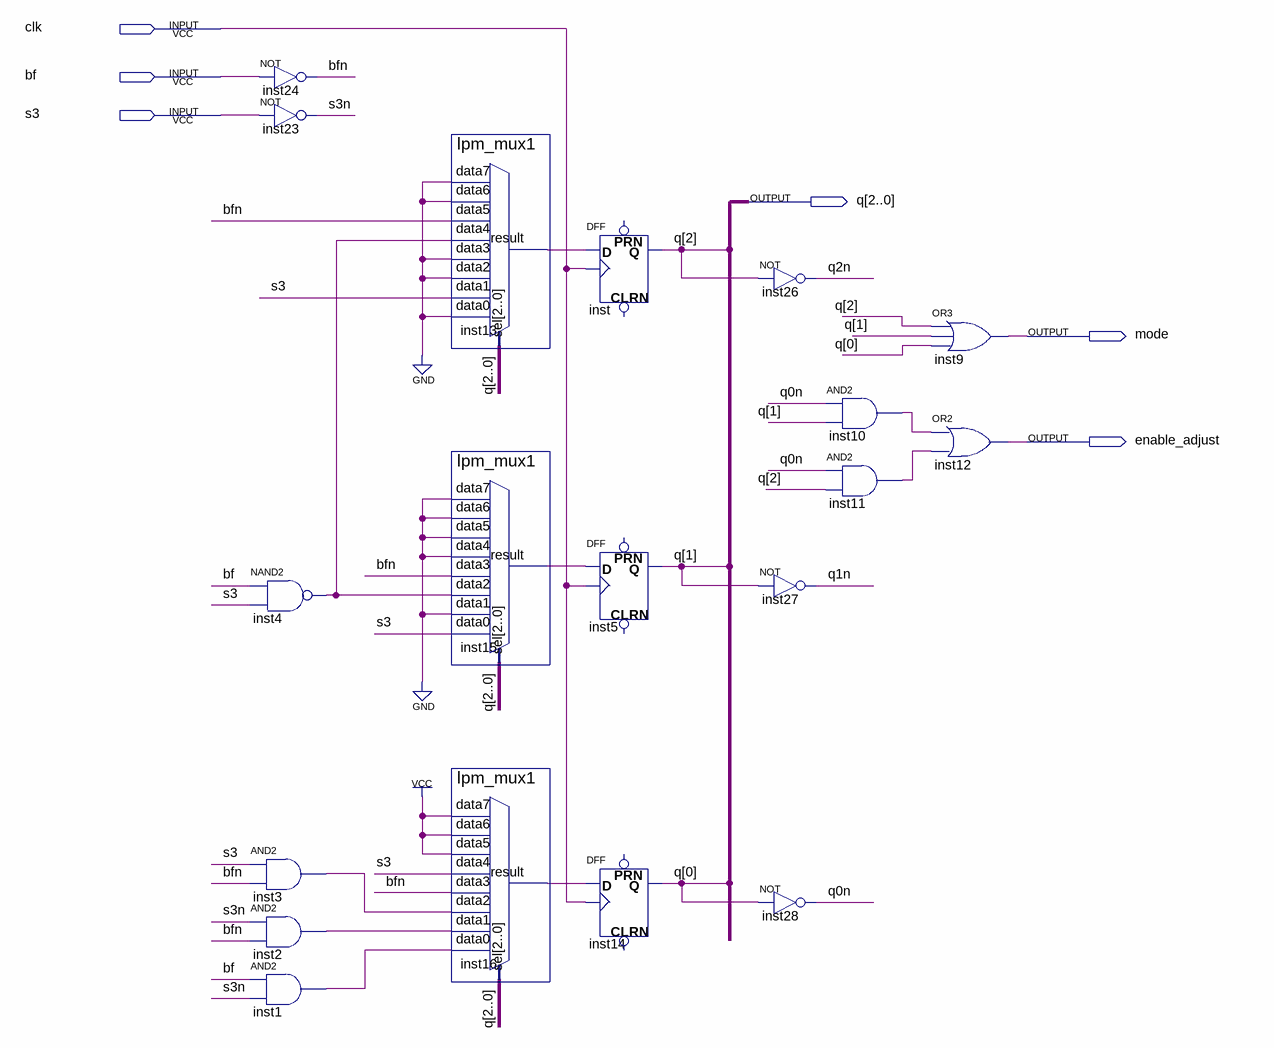
[diagram p0: schematic sheet]
// Quartus schematic ctrl_state_machine.bdf as structural Verilog: 19 symbols, 6 pins
module ctrl_state_machine (
  input  clk,
  input  bf,
  input  s3,
  output [2:0] q,
  output mode,
  output enable_adjust
);

  wire bfn, inst1_out, inst2_out, inst3_out, inst4_out, inst10_out, inst11_out, inst13_result, inst15_result,
       inst16_result, q0n, q1n, q2n, s3n;

  not inst24 (bfn, bf);
  not inst23 (s3n, s3);
  nand inst4 (inst4_out, bf, s3);
  and inst3 (inst3_out, s3, bfn);
  and inst2 (inst2_out, s3n, bfn);
  and inst1 (inst1_out, bf, s3n);
  lpm_mux1 inst13 (
    .data7(1'b0), .data6(1'b0), .data5(bfn), .data4(inst4_out), .data3(1'b0), .data2(1'b0), .data1(s3),
    .data0(1'b0), .sel(q), .result(inst13_result));
  lpm_mux1 inst15 (
    .data7(1'b0), .data6(1'b0), .data5(1'b0), .data4(1'b0), .data3(bfn), .data2(inst4_out), .data1(1'b0),
    .data0(s3), .sel(q), .result(inst15_result));
  lpm_mux1 inst16 (
    .data7(1'b1), .data6(1'b1), .data5(1'b1), .data4(s3), .data3(bfn), .data2(inst3_out), .data1(inst2_out),
    .data0(inst1_out), .sel(q), .result(inst16_result));
  DFF inst (.CLK(clk), .D(inst13_result), .Q(q[2]));  // open: CLRN, PRN
  DFF inst5 (.CLK(clk), .D(inst15_result), .Q(q[1]));  // open: CLRN, PRN
  DFF inst14 (.CLK(clk), .D(inst16_result), .Q(q[0]));  // open: CLRN, PRN
  not inst26 (q2n, q[2]);
  not inst27 (q1n, q[1]);
  not inst28 (q0n, q[0]);
  and inst10 (inst10_out, q0n, q[1]);
  and inst11 (inst11_out, q0n, q[2]);
  or inst9 (mode, q[2], q[1], q[0]);
  or inst12 (enable_adjust, inst10_out, inst11_out);
endmodule
